# Altium schematic sheet SolarSenseBoard.SchDoc: Solar Sense Slave
size Letter; SheetNumber: 3; SheetTotal: 4; Website: www.uwmidsun.com
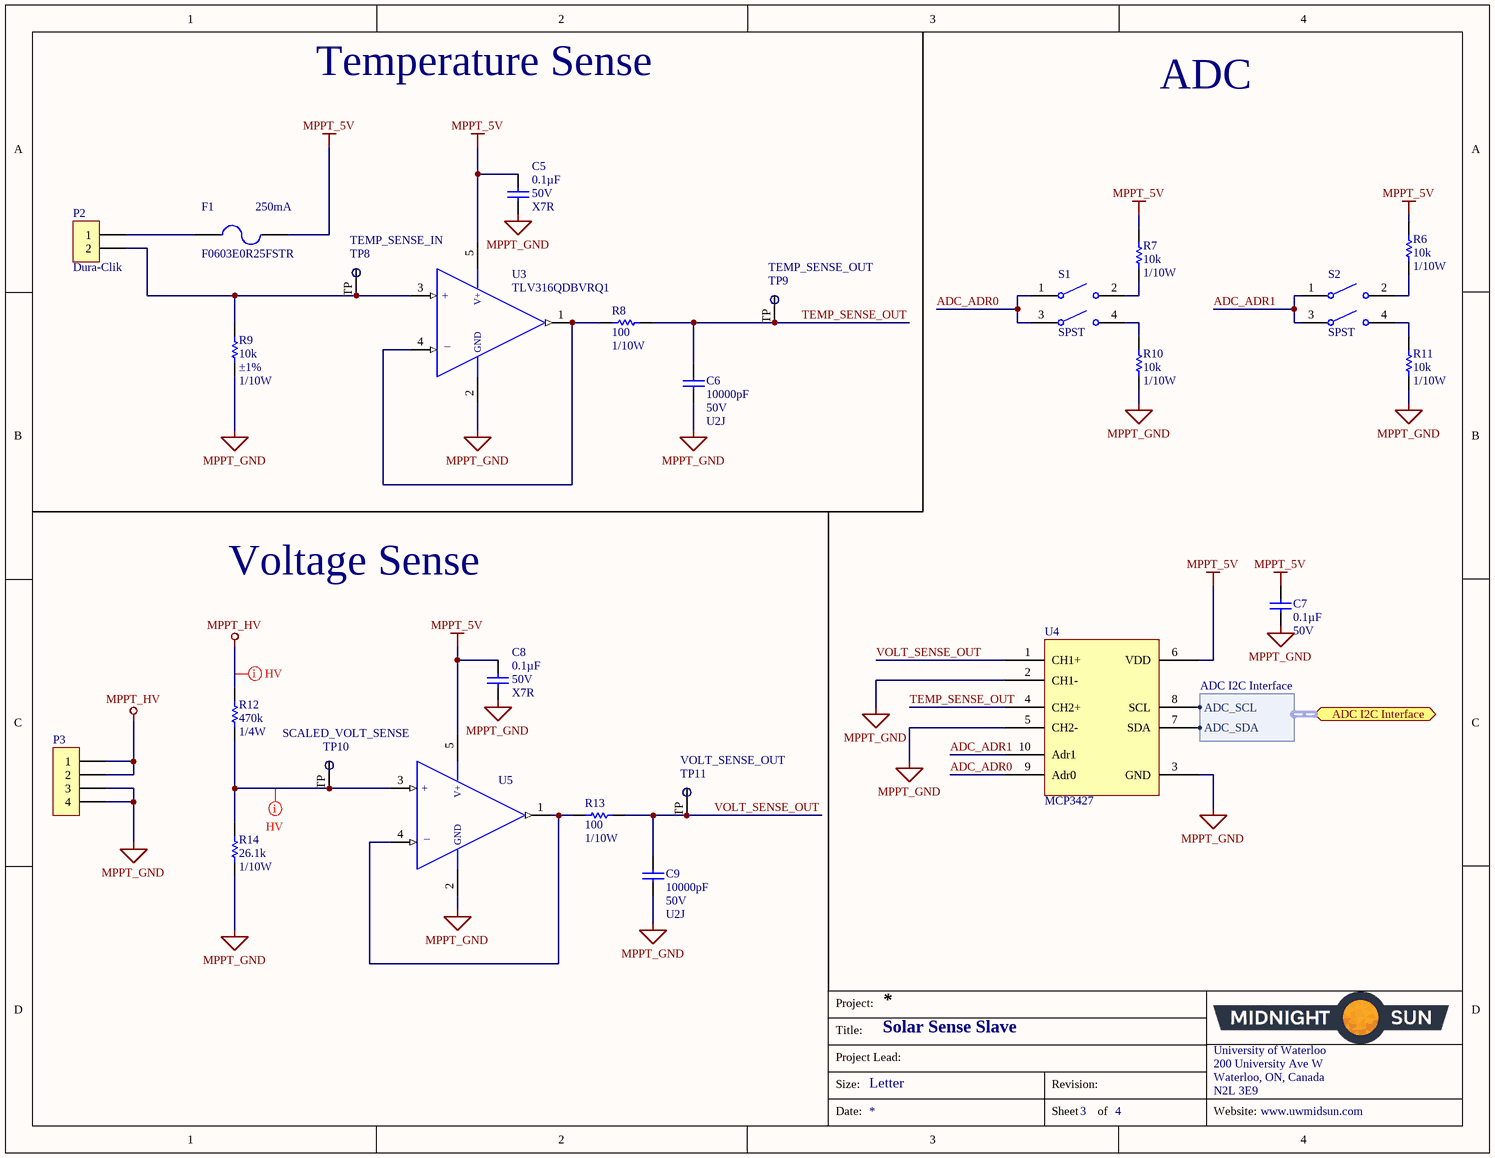
[diagram p0: SolarSenseBoard.SchDoc]

## Parts
C5  Capacitance: 0.1µF  Voltage: 50V  Temperature Coefficient: X7R  [CAP, 0603]  (hidden comment: CAP CER 0.1UF 50V 10% X7R 0603)
C6  Capacitance: 10000pF  Voltage: 50V  Temperature Coefficient: U2J  [CAP, 0603]  (hidden comment: CAP CER 10nF 50V 5% X7R 0603)
C7  Capacitance: 0.1µF  Voltage: 50V  [CAP, 0603]  (hidden comment: CAP CER 0.1UF 50V 10% X7R 0603)
C8  Capacitance: 0.1µF  Voltage: 50V  Temperature Coefficient: X7R  [CAP, 0603]  (hidden comment: CAP CER 0.1UF 50V 10% X7R 0603)
C9  Capacitance: 10000pF  Voltage: 50V  Temperature Coefficient: U2J  [CAP, 0603]  (hidden comment: CAP CER 10nF 50V 5% X7R 0603)
F1  Manufacturer Part Number: F0603E0R25FSTR  Fuse Current: 250mA  [RES, 0603]  (hidden comment: FUSE 250MA 32VDC 0603)
P2  Dura-Clik  [CONN, 2POS Dura-Click Vertical]
P3  CONN 4POS MX150L  [CONN, 4POS MX150L]  (value not drawn)
R6  Resistance: 10k  Power: 1/10W  [RES, 0603]  (hidden comment: RES 10K OHM 1% 1/10W 0603)
R7  Resistance: 10k  Power: 1/10W  [RES, 0603]  (hidden comment: RES 10K OHM 1% 1/10W 0603)
R8  Resistance: 100  Power: 1/10W  [RES, 0603]  (hidden comment: RES 100 OHM 1% 1/10W 0603)
R9  Resistance: 10k  Tolerance: ±1%  Power: 1/10W  [RES, 0603]  (hidden comment: RES 10K OHM 1% 1/10W 0603)
R10  Resistance: 10k  Power: 1/10W  [RES, 0603]  (hidden comment: RES 10K OHM 1% 1/10W 0603)
R11  Resistance: 10k  Power: 1/10W  [RES, 0603]  (hidden comment: RES 10K OHM 1% 1/10W 0603)
R12  Resistance: 470k  Power: 1/4W  [RES, 0603]  (hidden comment: RES 470K OHM 1% 1/4W 0603)
R13  Resistance: 100  Power: 1/10W  [RES, 0603]  (hidden comment: RES 100 OHM 1% 1/10W 0603)
R14  Resistance: 26.1k  Power: 1/10W  [RES, 0603]  (hidden comment: RES 26.1K OHM 1% 1/10W 0603)
S1  SPST  [SW SPST 2POS DIP 0.1A 20V]
S2  SPST  [SW SPST 2POS DIP 0.1A 20V]
TP8  TEMP_SENSE_IN  [Test Point]  (no BOM)
TP9  TEMP_SENSE_OUT  [Test Point]
TP10  SCALED_VOLT_SENSE  [Test Point]  (no BOM)
TP11  VOLT_SENSE_OUT  [Test Point]
U3  Manufacturer Part Number 1: TLV316QDBVRQ1  [IC OP AMP GP RR 10MHZ SOT-23-5]  (hidden comment: IC OP AMP GEN PURPOSE RR 10MHZ SOT-23-5)
U4  Base Part Number: MCP3427  [IC ADC MCP3427]  (hidden comment: IC ADC MCP3427 10MSOP)
U5  IC OP AMP GEN PURPOSE RR 10MHZ SOT-23-5  [IC OP AMP GP RR 10MHZ SOT-23-5]  (value not drawn)

## Ports
ADC I2C Interface (harness ADC I2C Interface)

## Harnesses
ADC I2C Interface: ADC_SCL, ADC_SDA

## Nets
MPPT_5V: C5.1 C7.1 C8.1 F1.2 R6.1 R7.1 U3.5(VDD) U4.6(VDD) U5.5(VDD)
MPPT_GND: C5.2 C6.2 C7.2 C8.2 C9.2 P3.3 P3.4 R9.2 R10.2 R11.2 R14.2 U3.2(VSS) U4.2(CH1-) U4.3(GND) U4.5(CH2-) U5.2(VSS)
MPPT_HV: P3.1 P3.2 R12.1
ADC_ADR0: S1.1 S1.3 U4.9(Adr0)
ADC_ADR1: S2.1 S2.3 U4.10(Adr1)
TEMP_SENSE_OUT: C6.1 R8.2 TP9.TP U4.4(CH2+)
VOLT_SENSE_OUT: C9.1 R13.2 TP11.TP U4.1(CH1+)
NetF1_1: F1.1 P2.1
NetP2_2: P2.2 R9.1 TP8.TP U3.3(+IN)
NetR6_2: R6.2 S2.2
NetR7_2: R7.2 S1.2
NetR8_1: R8.1 U3.1(OUTPUT) U3.4(-IN)
NetR10_1: R10.1 S1.4
NetR11_1: R11.1 S2.4
NetR12_2: R12.2 R14.1 TP10.TP U5.3(+IN)
NetR13_1: R13.1 U5.1(OUTPUT) U5.4(-IN)
NetU4_7: U4.7(SDA) ; port ADC I2C Interface.ADC_SDA
NetU4_8: U4.8(SCL) ; port ADC I2C Interface.ADC_SCL

## Layout directives
net class HV: MPPT_HV, NetR12_2

## Notes on the sheet
- Temperature Sense
- ADC
- Voltage Sense
- Project:
- Title:
- Size:
- Project Lead:
- Letter
- Revision:
- University of Waterloo
- 200 University Ave W
- Waterloo, ON, Canada
- N2L 3E9
- Date:
- Sheet
- of
- Website:
- (in symbol IC OP AMP GEN PURPOSE RR 10MHZ SOT-23-5) V+; +; GND; _

## Library data of the parts
C5 C7 C8 = CAP CER 0.1UF 50V 10% X7R 0603: 0.10µF ±10% 50V Ceramic Capacitor X7R 0603 (1608 Metric); Manufacturer 1: AVX Corporation; Manufacturer Part Number 1: 06035C104KAT2A; Supplier 1: Digi-Key; Supplier Part Number 1: 478-5052-1-ND; Packaging: Cut Tape (CT); Part Status: Active; Operating Temperature: -55°C ~ 125°C; Ratings: -; Mounting Type: Surface Mount, MLCC; Package / Case: 0603 (1608 Metric); Size / Dimension: 0.063" L x 0.032" W (1.60mm x 0.81mm); Height - Seated (Max): -; Thickness (Max): 0.035" (0.90mm); Lead Spacing: -; Lead Style: -; ComponentLink1URL: http://datasheets.avx.com/X7RDielectric.pdf; ComponentLink1Description: http://datasheets.avx.com/X7RDielectric.pdf; Tolerance: ±10%
  C7: Temperature Coefficient: X7R
C6 C9 = CAP CER 10nF 50V 5% X7R 0603: 10000pF ±5% 50V Ceramic Capacitor U2J 0603 (1608 Metric); Manufacturer 1: KEMET; Manufacturer Part Number 1: C0603C103J5JAC7867; Supplier 1: Digi-Key; Supplier Part Number 1: 399-13384-1-ND; Packaging: Cut Tape (CT); Part Status: Active; Operating Temperature: -55°C ~ 125°C; Ratings: -; Failure Rate: -; Mounting Type: Surface Mount, MLCC; Package / Case: 0603 (1608 Metric); Size / Dimension: 0.063" L x 0.032" W (1.60mm x 0.80mm); Height - Seated (Max): -; Thickness (Max): 0.034" (0.87mm); Lead Spacing: -; Lead Style: -; ComponentLink1URL: http://www.kemet.com/docfinder?Partnumber=C0603C103J5JAC7867; ComponentLink1Description: http://www.kemet.com/docfinder?Partnumber=C0603C103J5JAC7867; Tolerance: ±5%
F1 = FUSE 250MA 32VDC 0603: Manufacturer: Kyocera AVX; Voltage Rating (DC): 32V; Resistance: 650mR; Fuse Type: Board Mount (Cartridge Style Excluded); Approvals: UL; Supplier 1: Digi-Key; Stock 1: 48569; Pricing 1: 1=0.41, 5=0.394, 10=0.381, 50=0.3206, 100=0.2662, 250=0.242, 500=0.2057, 1000=0.1815 (USD); Mount: Surface Mount; Case/Package: 0603; Number of Pins: 2; Case Code (Metric): 1608; Case Code (Imperial): 0603; Contact Plating: Tin,Matte; Terminal Material: Nickel; Min Operating Temperature: -55°C; Max Operating Temperature: 125°C; Package Quantity: 1; Current Rating: 250mA; Packaging: Tape and Reel; Voltage Rating: 32V; Voltage Rating (AC): 32V; Max Voltage Rating (DC): 32V; DC Cold Resistance: 650mR; Composition: Thin Film; Length: 1.6mm; Height: 0.63mm; Width: 0.81mm; Depth: 0.81mm; Radiation Hardening: No; REACH SVHC: No SVHC; Lead Free: Lead Free; ComponentLink1URL: https://datasheet.ciiva.com/301/accug2-301328.pdf; ComponentLink1Description: https://datasheet.ciiva.com/301/accug2-301328.pdf; ComponentLink2URL: https://datasheet.ciiva.com/301/accug2-301329.pdf; ComponentLink2Description: https://datasheet.ciiva.com/301/accug2-301329.pdf; ComponentLink3URL: https://datasheet.ciiva.com/7650/accugrd-7650774.pdf; ComponentLink3Description: https://datasheet.ciiva.com/7650/accugrd-7650774.pdf; ComponentLink4URL: https://datasheet.ciiva.com/28473/1819437-28473548.pdf; ComponentLink4Description: https://datasheet.ciiva.com/28473/1819437-28473548.pdf; ComponentLink5URL: https://datasheet.ciiva.com/301/accug2-301327.pdf; ComponentLink5Description: https://datasheet.ciiva.com/301/accug2-301327.pdf; Supplier Part Number 1: 478-2858-1-ND
P2 = CONN 2POS DURA-CLIK 0.079" VERT: 2 Positions Header, Shrouded Connector 0.079" (2.00mm) Surface Mount, Vertical Tin; Manufacturer: Molex, LLC; Manufacturer Part Number: 5600200220; Style: Board to Cable/Wire; Shrouding: Shrouded - 4 Wall; Number of Positions: 2; Number of Positions Loaded: All; Mated Stacking Heights: 9.3mm; Supplier 1: Digi-Key; RoHS: RoHS Compliant; Category: Connectors, Interconnects; Stock 1: 11912; Pricing 1: 1=1.16, 10=1.012, 25=0.952, 50=0.9122, 100=0.8727, 250=0.79336 (CAD); Packaging: Cut Tape (CT); Part Status: Active; Connector Type: Header; Contact Type: Male Pin; Pitch - Mating: 0.079" (2.00mm); Number of Rows: 1; Row Spacing - Mating: -; Mounting Type: Surface Mount; Termination: Solder; Fastening Type: Latch Lock; Contact Length - Mating: -; Contact Length - Post: -; Overall Contact Length: -; Insulation Height: 0.315" (8.00mm); Contact Shape: Square; Contact Finish - Mating: Tin; Contact Finish Thickness - Mating: -; Contact Finish - Post: Tin; Contact Material: Copper Alloy; Insulation Material: Polyamide (PA), Nylon; Features: Solder Retention; Operating Temperature: -; Ingress Protection: -; Material Flammability Rating: -; Insulation Color: Natural; Current Rating: -; Voltage Rating: -; Contact Finish Thickness - Post: -; Applications: Automotive, Industrial; ComponentLink1URL: http://www.molex.com/pdm_docs/sd/5600200220_sd.pdf; ComponentLink1Description: http://www.molex.com/pdm_docs/sd/5600200220_sd.pdf; Supplier Part Number 1: WM10862CT-ND
P3 = CONN 4POS MX150L: Connector Header Panel Mount, Through Hole, Right Angle 4 position 0.230" (5.84mm)
R6 R7 R9-R11 = RES 10K OHM 1% 1/10W 0603: RES SMD 10K OHM 1% 1/10W 0603; Manufacturer 1: Yageo; Manufacturer Part Number 1: RC0603FR-0710KL; Temperature Coefficient: ±100ppm/°C; Supplier 1: Digi-Key; Supplier Part Number 1: 311-10.0KHRCT-ND; Packaging: Cut Tape (CT); Part Status: Active; Composition: Thick Film; Operating Temperature: -55°C ~ 155°C; Package / Case: 0603 (1608 Metric); Supplier Device Package: 0603; Size / Dimension: 0.063" L x 0.031" W (1.60mm x 0.80mm); Height - Seated (Max): 0.022" (0.55mm); Failure Rate: -; ComponentLink1URL: http://www.yageo.com/documents/recent/PYu-RC_Group_51_RoHS_L_7.pdf; ComponentLink1Description: http://www.yageo.com/documents/recent/PYu-RC_Group_51_RoHS_L_7.pdf
  R6 R7 R10 R11: Tolerance: ±1%
R8 R13 = RES 100 OHM 1% 1/10W 0603: 100 Ohm ±1% 0.1W, 1/10W Chip Resistor 0603 (1608 Metric) Moisture Resistant Thick Film; Manufacturer 1: Yageo; Manufacturer Part Number 1: RC0603FR-07100RL; Temperature Coefficient: ±100ppm/°C; Supplier 1: Digi-Key; Supplier Part Number 1: 311-100HRCT-ND; Packaging: Cut Tape (CT); Part Status: Active; Composition: Thick Film; Operating Temperature: -55°C ~ 155°C; Package / Case: 0603 (1608 Metric); Supplier Device Package: 0603; Size / Dimension: 0.063" L x 0.031" W (1.60mm x 0.80mm); Height - Seated (Max): 0.022" (0.55mm); Failure Rate: -; ComponentLink1URL: http://www.yageo.com/documents/recent/PYu-RC_Group_51_RoHS_L_7.pdf; ComponentLink1Description: http://www.yageo.com/documents/recent/PYu-RC_Group_51_RoHS_L_7.pdf; Tolerance: ±1%
R12 = RES 470K OHM 1% 1/4W 0603: RES SMD 470K OHM 1% 1/4W 0603; Manufacturer 1: Panasonic Electronic Components; Manufacturer Part Number 1: ERJ-PA3F4703V; Temperature Coefficient: ±100ppm/°C; Supplier 1: Digi-Key; Supplier Part Number 1: P470KBYCT-ND; Packaging: Cut Tape (CT); Part Status: Active; Composition: Thick Film; Operating Temperature: -55°C ~ 155°C; Package / Case: 0603 (1608 Metric); Supplier Device Package: 0603; Size / Dimension: 0.063" L x 0.031" W (1.60mm x 0.80mm); Height - Seated (Max): 0.022" (0.55mm); Failure Rate: -; ComponentLink1URL: https://industrial.panasonic.com/cdbs/www-data/pdf/RDO0000/AOA0000C291.pdf; ComponentLink1Description: https://industrial.panasonic.com/cdbs/www-data/pdf/RDO0000/AOA0000C291.pdf; Tolerance: ±1%
R14 = RES 26.1K OHM 1% 1/10W 0603: RES SMD 26.1K OHM 1% 1/10W 0603; Manufacturer 1: Yageo; Manufacturer Part Number 1: RC0603FR-0726K1L; Temperature Coefficient: ±100ppm/°C; Supplier 1: Digi-Key; Supplier Part Number 1: 311-26.1KHRCT-ND; Packaging: Cut Tape (CT); Part Status: Active; Composition: Thick Film; Operating Temperature: -55°C ~ 155°C; Package / Case: 0603 (1608 Metric); Supplier Device Package: 0603; Size / Dimension: 0.063" L x 0.031" W (1.60mm x 0.80mm); Height - Seated (Max): 0.022" (0.55mm); Failure Rate: -; ComponentLink1URL: http://www.yageo.com/documents/recent/PYu-RC_Group_51_RoHS_L_7.pdf; ComponentLink1Description: http://www.yageo.com/documents/recent/PYu-RC_Group_51_RoHS_L_7.pdf; Tolerance: ±1%
S1 S2 = SW SPST 2POS DIP 0.1A 20V: SWITCH SLIDE DIP SPST 100MA 20V; Manufacturer: CTS Electrocomponents; Manufacturer Part Number: 219-2MST; Voltage Rating: 20VDC; Actuator Type: Slide (Standard); Actuator Level: Raised; Pitch: 0.100" (2.54mm), Full; Washable: Yes; Electrical Life: 2,000 Cycles; Supplier 1: Digi-Key; RoHS: RoHS Compliant; Category: Switches; Stock 1: 444; Pricing 1: 1=0.84, 10=0.818, 25=0.7708, 50=0.7234, 100=0.6921, 250=0.66056, 500=0.59762, 1000=0.55044, 5000=0.44822 (CAD); Packaging: Tube; Part Status: Active; Circuit: SPST; Current Rating: 100mA; Contact Material: Beryllium Copper; Contact Finish: Gold; Height Above Board: 0.170" (4.33mm); Mounting Type: Surface Mount; Termination Style: Gull Wing; Features: Epoxy Sealed Terminals, Tape Seal; Operating Temperature: -55°C ~ 85°C; Body Material: -; Length: 0.258" (6.55mm); Mechanical Life: -; ComponentLink1URL: https://www.ctscorp.com/wp-content/uploads/219.pdf; ComponentLink1Description: https://www.ctscorp.com/wp-content/uploads/219.pdf; Supplier Part Number 1: CT2192MST-ND
TP8-TP11 = Test Point
U3 = IC OP AMP GEN PURPOSE RR 10MHZ SOT-23-5: General Purpose Amplifier 1 Circuit Rail-to-Rail SOT-23-5; Manufacturer 1: Texas Instruments; Description 1: IC OP AMP GP RR 10MHZ 5-SOT-23; Number of Circuits: 1; Slew Rate: 6 V/µs; Current - Supply: 400µA; Current - Output / Channel: 50mA; Voltage - Supply, Single/Dual (±): 1.8 V ~ 5.5 V, ±0.9 V ~ 2.75 V; Supplier 1: Digi-Key; Supplier Part Number 1: 296-45323-1-ND; RoHS: RoHS Compliant; Category: Integrated Circuits (ICs); Stock 1: 1747; Pricing 1: 1=1.33, 10=1.185, 100=0.9234, 500=0.76276, 1000=0.60218 (CAD); Packaging: Cut Tape (CT); Part Status: Active; Amplifier Type: General Purpose; Output Type: Rail-to-Rail; -3db Bandwidth: -; Operating Temperature: -40°C ~ 125°C; Mounting Type: Surface Mount; Package / Case: SC-74A, SOT-753; Supplier Device Package: SOT-23-5; ComponentLink1URL: http://www.ti.com/lit/ds/symlink/tlv316-q1.pdf; ComponentLink1Description: http://www.ti.com/lit/ds/symlink/tlv316-q1.pdf
U4 = IC ADC MCP3427 10MSOP: 16 Bit Analog to Digital Converter 2 Input 1 Sigma-Delta 10-MSOP; Manufacturer: Microchip Technology; Manufacturer Part Number: MCP3427-E/UN; Number of Bits: 16; Sampling Rate (Per Second): 15; Number of Inputs: 2; Input Type: Differential; Data Interface: I²C; Configuration: MUX-PGA-ADC; Reference Type: Internal; Voltage - Supply, Analog: 2.7 V ~ 5.5 V; Supplier 1: Digi-Key; RoHS: RoHS Compliant; Category: Integrated Circuits (ICs); Stock 1: 3001; Pricing 1: 1=4.32, 25=3.6064, 100=3.2704 (CAD); Packaging: Tube; Part Status: Active; Ratio - S/H:ADC: -; Architecture: Sigma-Delta; Voltage - Supply, Digital: 2.7 V ~ 5.5 V; Features: PGA, Selectable Address; Operating Temperature: -40°C ~ 125°C; Package / Case: 10-TFSOP, 10-MSOP (0.118", 3.00mm Width); Supplier Device Package: 10-MSOP; ComponentLink1URL: http://www.microchip.com/mymicrochip/filehandler.aspx?ddocname=en546216; ComponentLink1Description: http://www.microchip.com/mymicrochip/filehandler.aspx?ddocname=en546216; Supplier Part Number 1: MCP3427-E/UN-ND
U5 = IC OP AMP GEN PURPOSE RR 10MHZ SOT-23-5: General Purpose Amplifier 1 Circuit Rail-to-Rail SOT-23-5; Manufacturer 1: Texas Instruments; Manufacturer Part Number 1: TLV316QDBVRQ1; Description 1: IC OP AMP GP RR 10MHZ 5-SOT-23; Number of Circuits: 1; Slew Rate: 6 V/µs; Current - Supply: 400µA; Current - Output / Channel: 50mA; Voltage - Supply, Single/Dual (±): 1.8 V ~ 5.5 V, ±0.9 V ~ 2.75 V; Supplier 1: Digi-Key; Supplier Part Number 1: 296-45323-1-ND; RoHS: RoHS Compliant; Category: Integrated Circuits (ICs); Stock 1: 1747; Pricing 1: 1=1.33, 10=1.185, 100=0.9234, 500=0.76276, 1000=0.60218 (CAD); Packaging: Cut Tape (CT); Part Status: Active; Amplifier Type: General Purpose; Output Type: Rail-to-Rail; -3db Bandwidth: -; Operating Temperature: -40°C ~ 125°C; Mounting Type: Surface Mount; Package / Case: SC-74A, SOT-753; Supplier Device Package: SOT-23-5; ComponentLink1URL: http://www.ti.com/lit/ds/symlink/tlv316-q1.pdf; ComponentLink1Description: http://www.ti.com/lit/ds/symlink/tlv316-q1.pdf